# Altium schematic sheet Connector.SchDoc
size A4
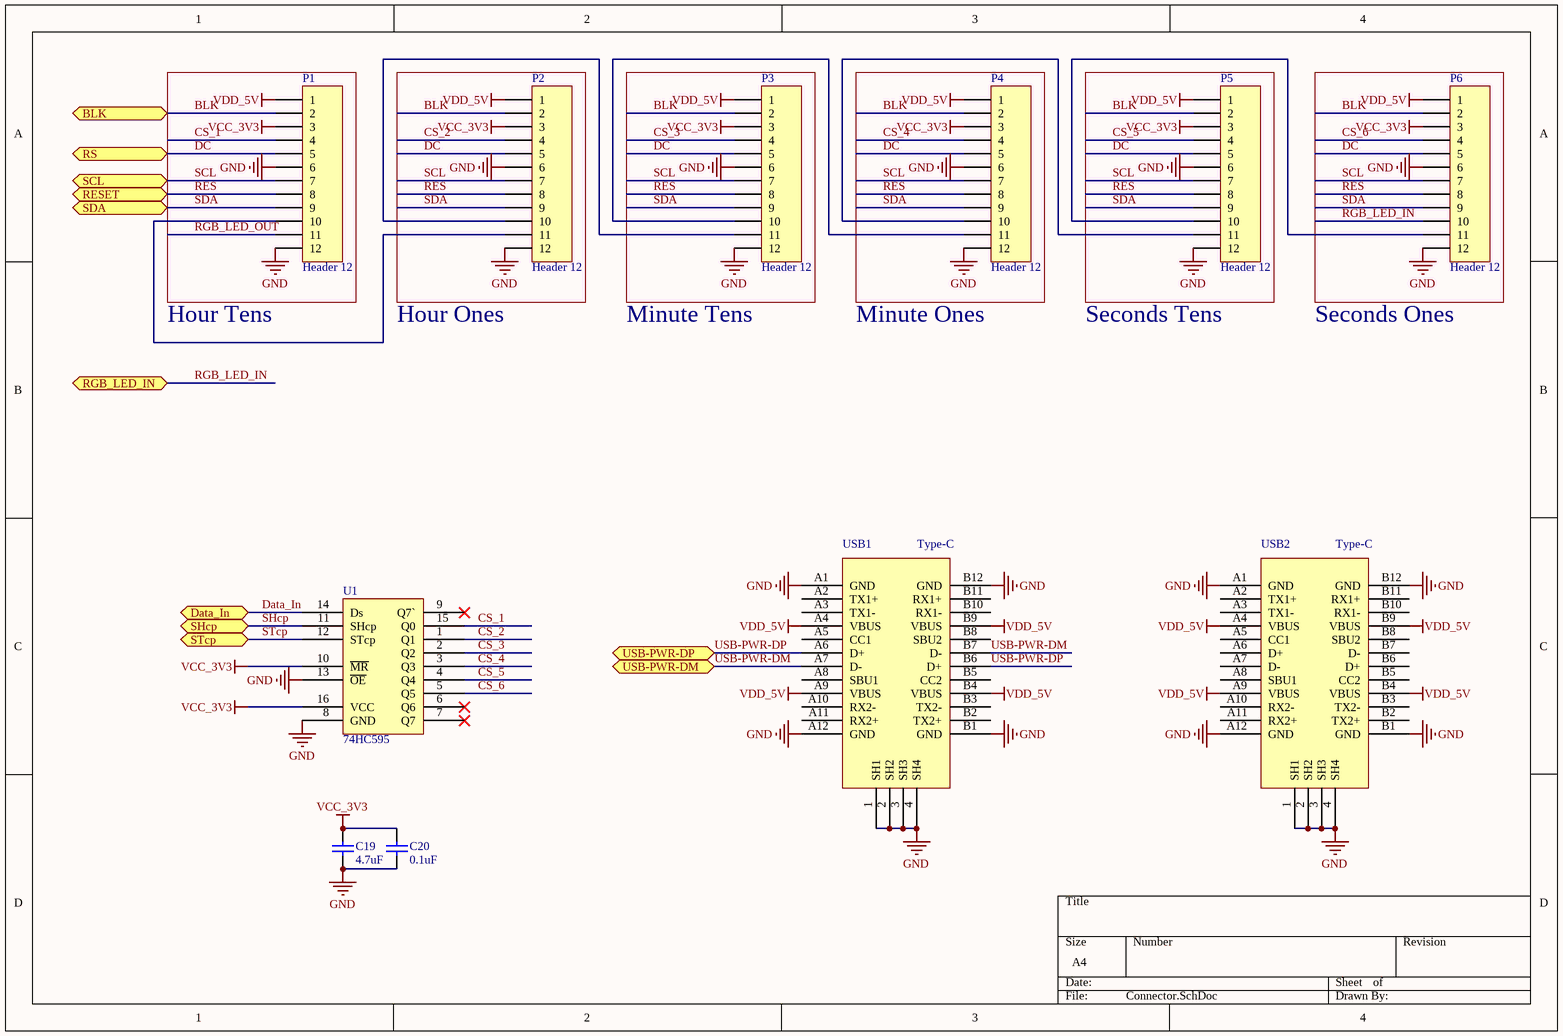
[diagram p0: Connector.SchDoc]

## Parts
C19  4.7uF  [C0603]
C20  0.1uF  [C0603]
P1  Header 12  [SIP12-1.27]
P2  Header 12  [SIP12-1.27]
P3  Header 12  [SIP12-1.27]
P4  Header 12  [SIP12-1.27]
P5  Header 12  [SIP12-1.27]
P6  Header 12  [SIP12-1.27]
U1  74HC595  [SO-16_L]
USB1  Type-C  [Type-C-TOP]
USB2  Type-C  [Type-C-TOP]

## Ports
BLK, Data_In, RESET, RGB_LED_IN, RS, SCL, SDA, SHcp, STcp, USB-PWR-DM, USB-PWR-DP

## Nets
GND: C19.2 C20.2 P1.6 P1.12 P2.6 P2.12 P3.6 P3.12 P4.6 P4.12 P5.6 P5.12 P6.6 P6.12 U1.8(GND) U1.13(~{OE}) USB1.1(SH1) USB1.2(SH2) USB1.3(SH3) USB1.4(SH4) USB1.A1(GND) USB1.A12(GND) USB1.B1(GND) USB1.B12(GND) USB2.1(SH1) USB2.2(SH2) USB2.3(SH3) USB2.4(SH4) USB2.A1(GND) USB2.A12(GND) USB2.B1(GND) USB2.B12(GND)
VCC_3V3: C19.1 C20.1 P1.3 P2.3 P3.3 P4.3 P5.3 P6.3 U1.10(~{MR}) U1.16(VCC)
VDD_5V: P1.1 P2.1 P3.1 P4.1 P5.1 P6.1 USB1.A4(VBUS) USB1.A9(VBUS) USB1.B4(VBUS) USB1.B9(VBUS) USB2.A4(VBUS) USB2.A9(VBUS) USB2.B4(VBUS) USB2.B9(VBUS)
BLK: P1.2 P2.2 P3.2 P4.2 P5.2 P6.2 ; port BLK
CS_1: P1.4 U1.15(Q0)
CS_2: P2.4 U1.1(Q1)
CS_3: P3.4 U1.2(Q2)
CS_4: P4.4 U1.3(Q3)
CS_5: P5.4 U1.4(Q4)
CS_6: P6.4 U1.5(Q5)
Data_In: U1.14(Ds) ; port Data_In
DC: P1.5 P2.5 P3.5 P4.5 P5.5 P6.5 ; port RS
RES: P1.8 P2.8 P3.8 P4.8 P5.8 P6.8 ; port RESET
RGB_LED_IN: P6.10 ; port RGB_LED_IN
RGB_LED_OUT: P1.11
SCL: P1.7 P2.7 P3.7 P4.7 P5.7 P6.7 ; port SCL
SDA: P1.9 P2.9 P3.9 P4.9 P5.9 P6.9 ; port SDA
SHcp: U1.11(SHcp) ; port SHcp
STcp: U1.12(STcp) ; port STcp
USB-PWR-DM: USB1.A7(D-) USB1.B7(D-) ; port USB-PWR-DM
USB-PWR-DP: USB1.A6(D+) USB1.B6(D+) ; port USB-PWR-DP
NetP1_10: P1.10 P2.11
NetP2_10: P2.10 P3.11
NetP3_10: P3.10 P4.11
NetP4_10: P4.10 P5.11
NetP5_10: P5.10 P6.11

Not connected (* = marked no-connect by the designer): U1 6(Q6)* 7(Q7)* 9(Q7`)*; USB1 A2(TX1+) A3(TX1-) A5(CC1) A8(SBU1) A10(RX2-) A11(RX2+) B2(TX2+) B3(TX2-) B5(CC2) B8(SBU2) B10(RX1-) B11(RX1+); USB2 A2(TX1+) A3(TX1-) A5(CC1) A6(D+) A7(D-) A8(SBU1) A10(RX2-) A11(RX2+) B2(TX2+) B3(TX2-) B5(CC2) B6(D+) B7(D-) B8(SBU2) B10(RX1-) B11(RX1+)

## Notes on the sheet
- Hour Tens
- Hour Ones
- Minute Tens
- Minute Ones
- Seconds Tens
- Seconds Ones

## Library data of the parts
C19 C20 = Cap: Capacitor; Value: 1.0uF/50V; Published: 8-Jun-2000; LatestRevisionDate: 17-Jul-2002; LatestRevisionNote: Re-released for DXP Platform.; PackageReference: RAD-0.3; Publisher: Altium Limited; PackageDescription: Radial Cap, Thru-Hole; 2 Leads; 0.3 in Pin Spacing
P1-P6 = Header 12: Header, 12-Pin; LatestRevisionDate: 17-Jul-2002; LatestRevisionNote: Re-released for DXP Platform.; Publisher: Altium Limited
USB1 USB2 = USB-Type-C-TOP